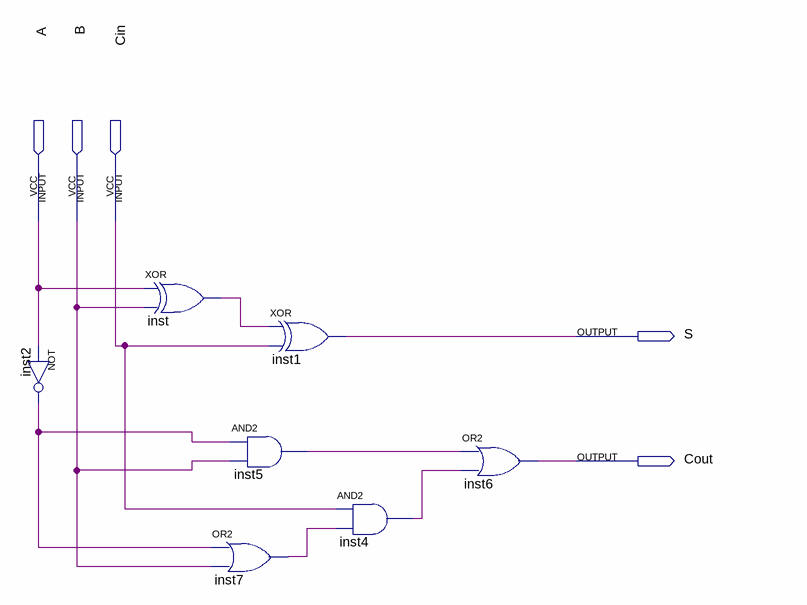
[diagram p0: schematic sheet]
// Quartus schematic SubtratorCompleto.bdf as structural Verilog: 7 symbols, 5 pins
module SubtratorCompleto (
  input  A,
  input  B,
  input  Cin,
  output S,
  output Cout
);

  wire inst2_out, inst4_out, inst5_out, inst7_out, inst_out;

  not inst2 (inst2_out, A);
  xor inst (inst_out, A, B);
  and inst5 (inst5_out, inst2_out, B);
  or inst7 (inst7_out, inst2_out, B);
  xor inst1 (S, inst_out, Cin);
  and inst4 (inst4_out, Cin, inst7_out);
  or inst6 (Cout, inst5_out, inst4_out);
endmodule
